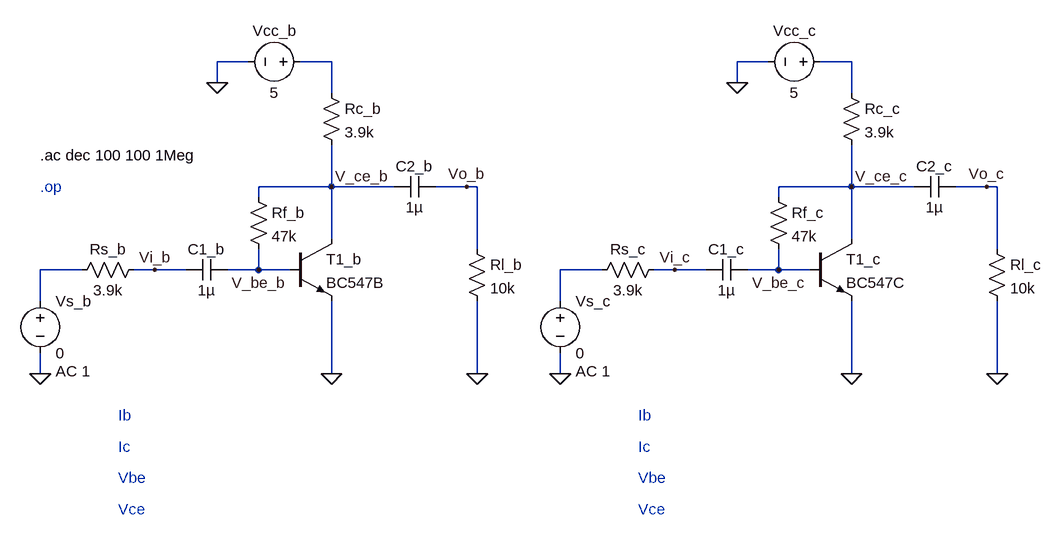
[diagram p0: schematic lab12_schematics.asc]
lab12_schematics.asc, the LTspice schematic file:
Version 4.1
SHEET 1 1608 680
WIRE 384 -240 336 -240
WIRE 512 -240 464 -240
WIRE 1184 -240 1136 -240
WIRE 1312 -240 1264 -240
WIRE 336 -208 336 -240
WIRE 1136 -208 1136 -240
WIRE 512 -192 512 -240
WIRE 1312 -192 1312 -240
WIRE 512 -48 512 -112
WIRE 512 -48 400 -48
WIRE 608 -48 512 -48
WIRE 720 -48 672 -48
WIRE 736 -48 720 -48
WIRE 1312 -48 1312 -112
WIRE 1312 -48 1200 -48
WIRE 1408 -48 1312 -48
WIRE 1520 -48 1472 -48
WIRE 1536 -48 1520 -48
WIRE 400 -32 400 -48
WIRE 1200 -32 1200 -48
WIRE 512 32 512 -48
WIRE 1312 32 1312 -48
WIRE 736 48 736 -48
WIRE 1536 48 1536 -48
WIRE 128 80 64 80
WIRE 240 80 208 80
WIRE 288 80 240 80
WIRE 400 80 400 48
WIRE 400 80 352 80
WIRE 448 80 400 80
WIRE 928 80 864 80
WIRE 1040 80 1008 80
WIRE 1088 80 1040 80
WIRE 1200 80 1200 48
WIRE 1200 80 1152 80
WIRE 1248 80 1200 80
WIRE 64 128 64 80
WIRE 864 128 864 80
WIRE 64 240 64 208
WIRE 512 240 512 128
WIRE 736 240 736 128
WIRE 864 240 864 208
WIRE 1312 240 1312 128
WIRE 1536 240 1536 128
FLAG 736 240 0
FLAG 512 240 0
FLAG 64 240 0
FLAG 240 80 Vi_b
FLAG 720 -48 Vo_b
FLAG 336 -208 0
FLAG 1536 240 0
FLAG 1312 240 0
FLAG 864 240 0
FLAG 1040 80 Vi_c
FLAG 1520 -48 Vo_c
FLAG 1136 -208 0
FLAG 400 80 V_be_b
FLAG 1200 80 V_be_c
FLAG 512 -48 V_ce_b
FLAG 1312 -48 V_ce_c
DATAFLAG 336 368 "Ic(T1_b)"
DATAFLAG 336 320 "Ib(T1_b)"
DATAFLAG 336 416 "V(v_be_b)"
DATAFLAG 336 464 "V(v_ce_b)"
DATAFLAG 1136 368 "Ic(T1_c)"
DATAFLAG 1136 320 "Ib(T1_c)"
DATAFLAG 1136 416 "V(v_be_c)"
DATAFLAG 1136 464 "V(v_ce_c)"
SYMBOL voltage 64 112 R0
WINDOW 123 24 124 Left 2
WINDOW 39 0 0 Left 0
SYMATTR Value2 AC 1
SYMATTR InstName Vs_b
SYMATTR Value 0
SYMBOL res 112 96 R270
WINDOW 0 32 56 VTop 2
WINDOW 3 0 56 VBottom 2
SYMATTR InstName Rs_b
SYMATTR Value 3.9k
SYMBOL cap 352 64 R90
WINDOW 0 0 32 VBottom 2
WINDOW 3 32 32 VTop 2
SYMATTR InstName C1_b
SYMATTR Value 1µ
SYMBOL res 384 -48 R0
SYMATTR InstName Rf_b
SYMATTR Value 47k
SYMBOL npn 448 32 R0
SYMATTR InstName T1_b
SYMATTR Value BC547B
SYMBOL res 496 -208 R0
SYMATTR InstName Rc_b
SYMATTR Value 3.9k
SYMBOL voltage 480 -240 R90
WINDOW 0 -32 56 VBottom 2
WINDOW 3 32 56 VTop 2
WINDOW 123 0 0 Left 0
WINDOW 39 0 0 Left 0
SYMATTR InstName Vcc_b
SYMATTR Value 5
SYMBOL cap 672 -64 R90
WINDOW 0 0 32 VBottom 2
WINDOW 3 32 32 VTop 2
SYMATTR InstName C2_b
SYMATTR Value 1µ
SYMBOL res 720 32 R0
SYMATTR InstName Rl_b
SYMATTR Value 10k
SYMBOL voltage 864 112 R0
WINDOW 123 24 124 Left 2
WINDOW 39 0 0 Left 0
SYMATTR Value2 AC 1
SYMATTR InstName Vs_c
SYMATTR Value 0
SYMBOL res 912 96 R270
WINDOW 0 32 56 VTop 2
WINDOW 3 0 56 VBottom 2
SYMATTR InstName Rs_c
SYMATTR Value 3.9k
SYMBOL cap 1152 64 R90
WINDOW 0 0 32 VBottom 2
WINDOW 3 32 32 VTop 2
SYMATTR InstName C1_c
SYMATTR Value 1µ
SYMBOL res 1184 -48 R0
SYMATTR InstName Rf_c
SYMATTR Value 47k
SYMBOL npn 1248 32 R0
SYMATTR InstName T1_c
SYMATTR Value BC547C
SYMBOL res 1296 -208 R0
SYMATTR InstName Rc_c
SYMATTR Value 3.9k
SYMBOL voltage 1280 -240 R90
WINDOW 0 -32 56 VBottom 2
WINDOW 3 32 56 VTop 2
WINDOW 123 0 0 Left 0
WINDOW 39 0 0 Left 0
SYMATTR InstName Vcc_c
SYMATTR Value 5
SYMBOL cap 1472 -64 R90
WINDOW 0 0 32 VBottom 2
WINDOW 3 32 32 VTop 2
SYMATTR InstName C2_c
SYMATTR Value 1µ
SYMBOL res 1520 32 R0
SYMATTR InstName Rl_c
SYMATTR Value 10k
TEXT 64 -48 Left 2 ;.op
TEXT 64 -96 Left 2 !.ac dec 100 100 1Meg
TEXT 184 304 Left 2 ;Ib
TEXT 184 352 Left 2 ;Ic
TEXT 184 448 Left 2 ;Vce
TEXT 184 400 Left 2 ;Vbe
TEXT 984 304 Left 2 ;Ib
TEXT 984 352 Left 2 ;Ic
TEXT 984 448 Left 2 ;Vce
TEXT 984 400 Left 2 ;Vbe

The netlist it stands for:
* lab12_schematics.asc
Vs_b N003 0 0 AC 1
Rs_b N003 Vi_b 3.9k
C1_b V_be_b Vi_b 1µ
Rf_b V_ce_b V_be_b 47k
Q§T1_b V_ce_b V_be_b 0 0 BC547B
Rc_b N001 V_ce_b 3.9k
Vcc_b N001 0 5
C2_b Vo_b V_ce_b 1µ
Rl_b Vo_b 0 10k
Vs_c N004 0 0 AC 1
Rs_c N004 Vi_c 3.9k
C1_c V_be_c Vi_c 1µ
Rf_c V_ce_c V_be_c 47k
Q§T1_c V_ce_c V_be_c 0 0 BC547C
Rc_c N002 V_ce_c 3.9k
Vcc_c N002 0 5
C2_c Vo_c V_ce_c 1µ
Rl_c Vo_c 0 10k
.model NPN NPN
.model PNP PNP
.lib standard.bjt
* .op
.ac dec 100 100 1Meg
* Ib
* Ic
* Vce
* Vbe
* Ib
* Ic
* Vce
* Vbe
.backanno
.end